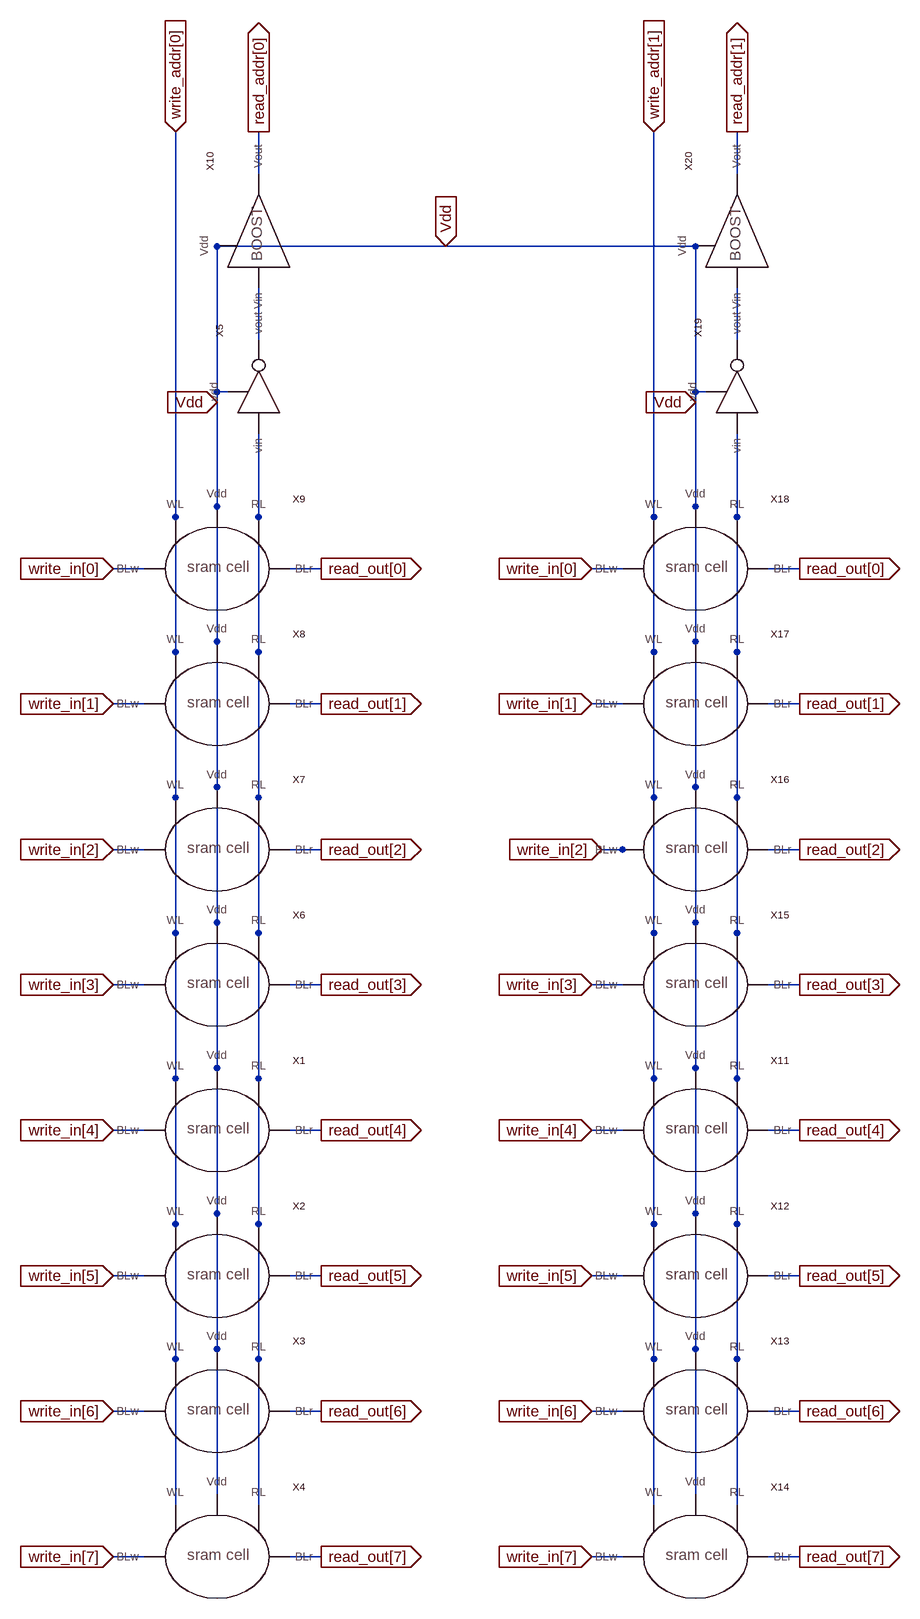
[diagram p0: schematic s_sram_block_2x8bit.asc]
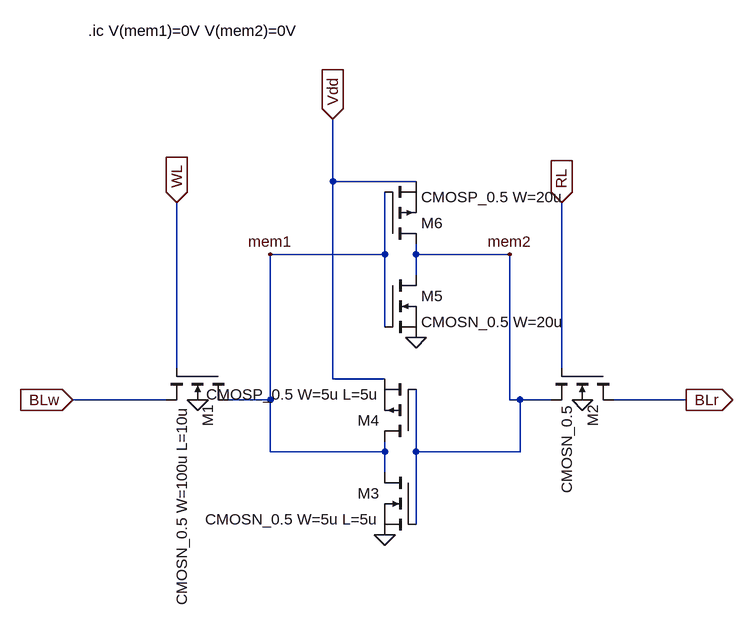
[diagram p1: sub-circuit s_sram_cell.asc]
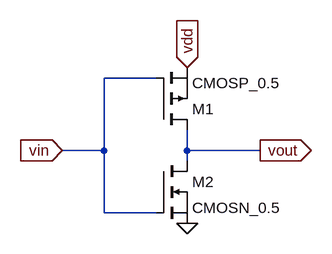
[diagram p2: sub-circuit s_inv.asc]
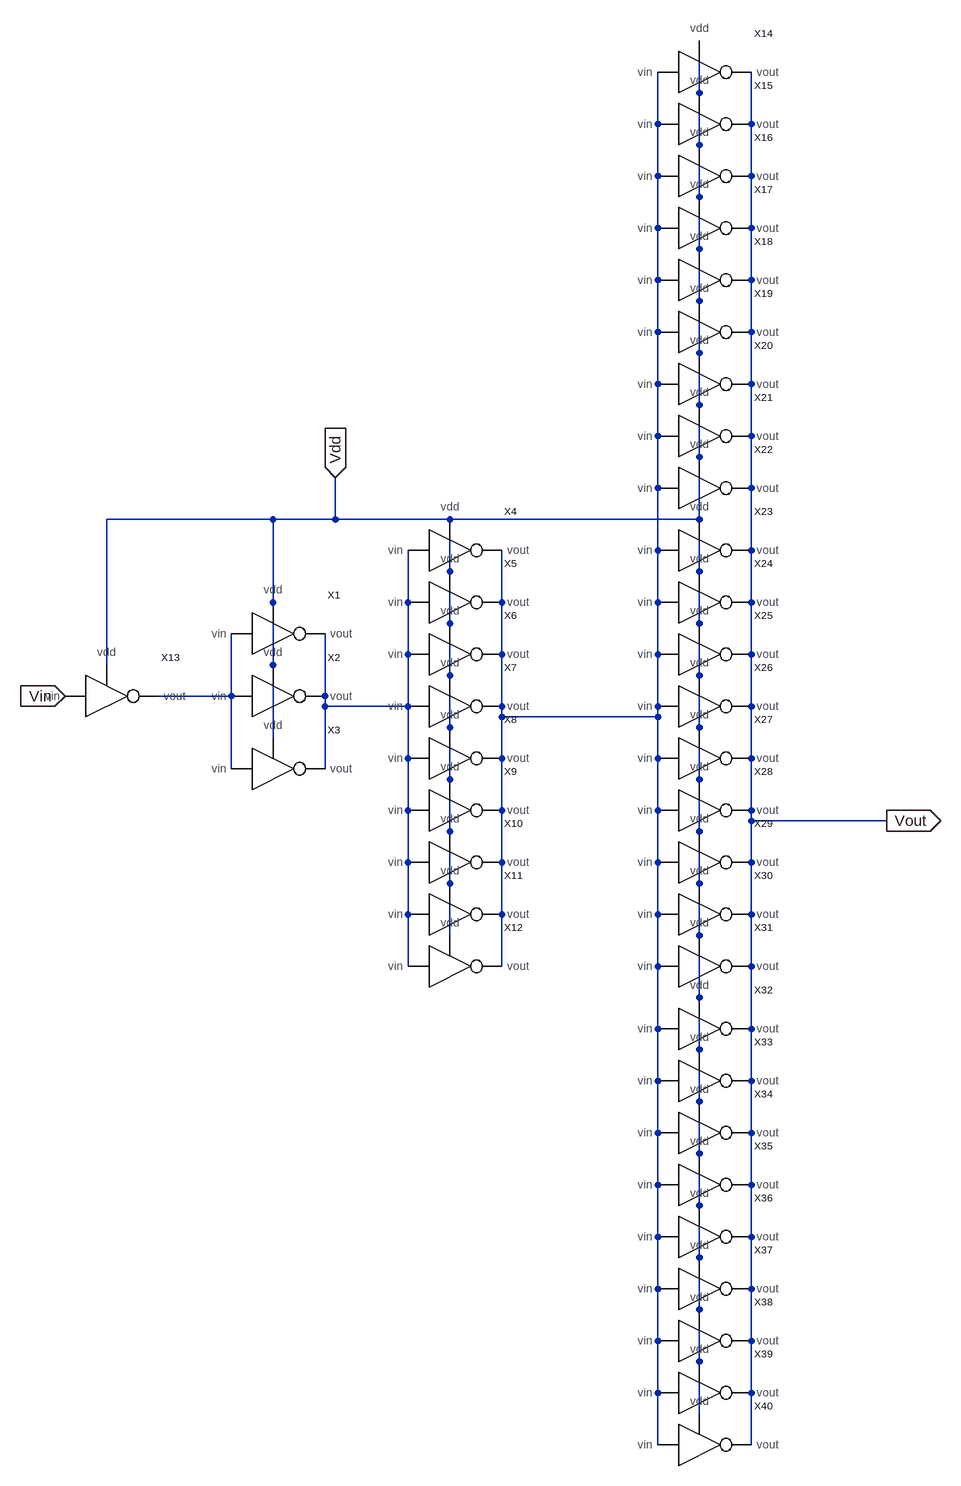
[diagram p3: sub-circuit s_current_boost.asc]
s_sram_block_2x8bit.asc, the LTspice schematic file:
Version 4
SHEET 1 1208 1108
WIRE 176 -1328 176 -1392
WIRE 912 -1328 912 -1392
WIRE 464 -1216 112 -1216
WIRE 848 -1216 464 -1216
WIRE 176 -1072 176 -1152
WIRE 912 -1072 912 -1152
WIRE 112 -992 112 -1216
WIRE 128 -992 112 -992
WIRE 848 -992 848 -1216
WIRE 864 -992 848 -992
WIRE 112 -976 112 -992
WIRE 848 -976 848 -992
WIRE 112 -816 112 -976
WIRE 848 -816 848 -976
WIRE 48 -800 48 -1392
WIRE 176 -800 176 -928
WIRE 784 -800 784 -1392
WIRE 912 -800 912 -928
WIRE 0 -720 -48 -720
WIRE 272 -720 224 -720
WIRE 736 -720 688 -720
WIRE 1008 -720 960 -720
WIRE 112 -608 112 -816
WIRE 848 -608 848 -816
WIRE 48 -592 48 -800
WIRE 176 -592 176 -800
WIRE 784 -592 784 -800
WIRE 912 -592 912 -800
WIRE 0 -512 -48 -512
WIRE 272 -512 224 -512
WIRE 736 -512 688 -512
WIRE 1008 -512 960 -512
WIRE 112 -384 112 -608
WIRE 848 -384 848 -608
WIRE 48 -368 48 -592
WIRE 176 -368 176 -592
WIRE 784 -368 784 -592
WIRE 912 -368 912 -592
WIRE 0 -288 -48 -288
WIRE 272 -288 224 -288
WIRE 736 -288 704 -288
WIRE 752 -288 736 -288
WIRE 1008 -288 960 -288
WIRE 112 -176 112 -384
WIRE 848 -176 848 -384
WIRE 48 -160 48 -368
WIRE 176 -160 176 -368
WIRE 784 -160 784 -368
WIRE 912 -160 912 -368
WIRE 0 -80 -48 -80
WIRE 272 -80 224 -80
WIRE 736 -80 688 -80
WIRE 1008 -80 960 -80
WIRE 112 48 112 -176
WIRE 848 48 848 -176
WIRE 48 64 48 -160
WIRE 176 64 176 -160
WIRE 784 64 784 -160
WIRE 912 64 912 -160
WIRE 0 144 -48 144
WIRE 272 144 224 144
WIRE 736 144 688 144
WIRE 1008 144 960 144
WIRE 112 272 112 48
WIRE 848 272 848 48
WIRE 48 288 48 64
WIRE 176 288 176 64
WIRE 784 288 784 64
WIRE 912 288 912 64
WIRE 0 368 -48 368
WIRE 272 368 224 368
WIRE 736 368 688 368
WIRE 1008 368 960 368
WIRE 112 480 112 272
WIRE 848 480 848 272
WIRE 48 496 48 288
WIRE 176 496 176 288
WIRE 784 496 784 288
WIRE 912 496 912 288
WIRE 0 576 -48 576
WIRE 272 576 224 576
WIRE 736 576 688 576
WIRE 1008 576 960 576
WIRE 112 704 112 480
WIRE 848 704 848 480
WIRE 48 720 48 496
WIRE 176 720 176 496
WIRE 784 720 784 496
WIRE 912 720 912 496
WIRE 0 800 -48 800
WIRE 272 800 224 800
WIRE 736 800 688 800
WIRE 1008 800 960 800
FLAG 112 -976 Vdd
IOPIN 112 -976 In
FLAG 48 -1392 write_addr[0]
IOPIN 48 -1392 In
FLAG 176 -1392 read_addr[0]
IOPIN 176 -1392 Out
FLAG 848 -976 Vdd
IOPIN 848 -976 In
FLAG 912 -1392 read_addr[1]
IOPIN 912 -1392 Out
FLAG 784 -1392 write_addr[1]
IOPIN 784 -1392 In
FLAG 272 -720 read_out[0]
IOPIN 272 -720 Out
FLAG 272 -512 read_out[1]
IOPIN 272 -512 Out
FLAG 272 -288 read_out[2]
IOPIN 272 -288 Out
FLAG 272 -80 read_out[3]
IOPIN 272 -80 Out
FLAG 272 144 read_out[4]
IOPIN 272 144 Out
FLAG 272 368 read_out[5]
IOPIN 272 368 Out
FLAG 272 576 read_out[6]
IOPIN 272 576 Out
FLAG 272 800 read_out[7]
IOPIN 272 800 Out
FLAG 464 -1216 Vdd
IOPIN 464 -1216 In
FLAG 1008 800 read_out[7]
IOPIN 1008 800 Out
FLAG 1008 576 read_out[6]
IOPIN 1008 576 Out
FLAG 1008 368 read_out[5]
IOPIN 1008 368 Out
FLAG 1008 144 read_out[4]
IOPIN 1008 144 Out
FLAG 1008 -80 read_out[3]
IOPIN 1008 -80 Out
FLAG 1008 -288 read_out[2]
IOPIN 1008 -288 Out
FLAG 1008 -512 read_out[1]
IOPIN 1008 -512 Out
FLAG 1008 -720 read_out[0]
IOPIN 1008 -720 Out
FLAG -48 -720 write_in[0]
IOPIN -48 -720 In
FLAG -48 -512 write_in[1]
IOPIN -48 -512 In
FLAG -48 -288 write_in[2]
IOPIN -48 -288 In
FLAG -48 -80 write_in[3]
IOPIN -48 -80 In
FLAG -48 144 write_in[4]
IOPIN -48 144 In
FLAG -48 368 write_in[5]
IOPIN -48 368 In
FLAG -48 576 write_in[6]
IOPIN -48 576 In
FLAG -48 800 write_in[7]
IOPIN -48 800 In
FLAG 688 -720 write_in[0]
IOPIN 688 -720 In
FLAG 688 -512 write_in[1]
IOPIN 688 -512 In
FLAG 704 -288 write_in[2]
IOPIN 704 -288 In
FLAG 688 -80 write_in[3]
IOPIN 688 -80 In
FLAG 688 144 write_in[4]
IOPIN 688 144 In
FLAG 688 368 write_in[5]
IOPIN 688 368 In
FLAG 688 576 write_in[6]
IOPIN 688 576 In
FLAG 688 800 write_in[7]
IOPIN 688 800 In
SYMBOL s_sram_cell 112 144 R0
SYMATTR InstName X1
SYMBOL s_sram_cell 112 368 R0
SYMATTR InstName X2
SYMBOL s_sram_cell 112 576 R0
SYMATTR InstName X3
SYMBOL s_sram_cell 112 800 R0
SYMATTR InstName X4
SYMBOL s_sram_cell 112 -80 R0
SYMATTR InstName X6
SYMBOL s_sram_cell 112 -288 R0
SYMATTR InstName X7
SYMBOL s_sram_cell 112 -512 R0
SYMATTR InstName X8
SYMBOL s_sram_cell 112 -720 R0
SYMATTR InstName X9
SYMBOL s_inv 176 -992 R270
SYMATTR InstName X5
SYMBOL s_current_boost 176 -1216 R270
SYMATTR InstName X10
SYMBOL s_sram_cell 848 144 R0
SYMATTR InstName X11
SYMBOL s_sram_cell 848 368 R0
SYMATTR InstName X12
SYMBOL s_sram_cell 848 576 R0
SYMATTR InstName X13
SYMBOL s_sram_cell 848 800 R0
SYMATTR InstName X14
SYMBOL s_sram_cell 848 -80 R0
SYMATTR InstName X15
SYMBOL s_sram_cell 848 -288 R0
SYMATTR InstName X16
SYMBOL s_sram_cell 848 -512 R0
SYMATTR InstName X17
SYMBOL s_sram_cell 848 -720 R0
SYMATTR InstName X18
SYMBOL s_inv 912 -992 R270
SYMATTR InstName X19
SYMBOL s_current_boost 912 -1216 R270
SYMATTR InstName X20

s_sram_cell.asc, the sub-circuit schematic file:
Version 4
SHEET 1 880 680
WIRE 48 -240 48 -336
WIRE 176 -240 48 -240
WIRE 128 -128 128 -224
WIRE 128 -128 -48 -128
WIRE 176 -128 176 -144
WIRE 320 -128 176 -128
WIRE 176 -96 176 -128
WIRE 128 -16 128 -128
WIRE -192 48 -192 -208
WIRE 400 48 400 -208
WIRE 48 64 48 -240
WIRE 128 64 48 64
WIRE -208 96 -352 96
WIRE -48 96 -48 -128
WIRE -48 96 -112 96
WIRE 320 96 320 -128
WIRE 336 96 320 96
WIRE 384 96 336 96
WIRE 592 96 480 96
WIRE -48 176 -48 96
WIRE 128 176 128 160
WIRE 128 176 -48 176
WIRE 176 176 176 80
WIRE 336 176 336 96
WIRE 336 176 176 176
WIRE 128 208 128 176
WIRE 176 288 176 176
FLAG -160 96 0
FLAG 432 96 0
FLAG 128 304 0
FLAG -192 -208 WL
IOPIN -192 -208 In
FLAG 400 -208 RL
IOPIN 400 -208 In
FLAG 176 0 0
FLAG 48 -336 Vdd
IOPIN 48 -336 In
FLAG -352 96 BLw
IOPIN -352 96 In
FLAG 592 96 BLr
IOPIN 592 96 Out
FLAG -48 -128 mem1
FLAG 320 -128 mem2
SYMBOL nmos4 -112 48 R90
SYMATTR InstName M1
SYMATTR Value CMOSN_0.5 W=100u L=10u
SYMBOL nmos4 480 48 R90
SYMATTR InstName M2
SYMATTR Value CMOSN_0.5
SYMBOL nmos 176 208 M0
SYMATTR InstName M3
SYMATTR Value CMOSN_0.5 W=5u L=5u
SYMBOL pmos 176 160 R180
SYMATTR InstName M4
SYMATTR Value CMOSP_0.5 W=5u L=5u
SYMBOL nmos 128 -96 R0
SYMATTR InstName M5
SYMATTR Value CMOSN_0.5 W=20u
SYMBOL pmos 128 -144 M180
SYMATTR InstName M6
SYMATTR Value CMOSP_0.5 W=20u
TEXT -328 -472 Left 2 !.ic V(mem1)=0V V(mem2)=0V

s_inv.asc, the sub-circuit schematic file:
Version 4
SHEET 1 880 680
WIRE 128 -112 48 -112
WIRE 48 0 48 -112
WIRE 48 0 -16 0
WIRE 176 0 176 -32
WIRE 288 0 176 0
WIRE 176 16 176 0
WIRE 48 96 48 0
WIRE 128 96 48 96
FLAG 288 0 vout
IOPIN 288 0 Out
FLAG -16 0 vin
IOPIN -16 0 In
FLAG 176 -128 vdd
IOPIN 176 -128 In
FLAG 176 112 0
SYMBOL pmos 128 -32 M180
SYMATTR InstName M1
SYMATTR Value CMOSP_0.5
SYMBOL nmos 128 16 R0
SYMATTR InstName M2
SYMATTR Value CMOSN_0.5

s_current_boost.asc, the sub-circuit schematic file:
Version 4
SHEET 1 1556 1460
WIRE 768 -704 768 -784
WIRE 704 -656 704 -736
WIRE 848 -656 848 -736
WIRE 768 -624 768 -704
WIRE 704 -576 704 -656
WIRE 848 -576 848 -656
WIRE 768 -544 768 -624
WIRE 704 -496 704 -576
WIRE 848 -496 848 -576
WIRE 768 -464 768 -544
WIRE 704 -416 704 -496
WIRE 848 -416 848 -496
WIRE 768 -384 768 -464
WIRE 704 -336 704 -416
WIRE 848 -336 848 -416
WIRE 768 -304 768 -384
WIRE 704 -256 704 -336
WIRE 848 -256 848 -336
WIRE 768 -224 768 -304
WIRE 704 -176 704 -256
WIRE 848 -176 848 -256
WIRE 768 -144 768 -224
WIRE 704 -96 704 -176
WIRE 848 -96 848 -176
WIRE 112 -48 -144 -48
WIRE 208 -48 208 -112
WIRE 208 -48 112 -48
WIRE 384 -48 208 -48
WIRE 768 -48 768 -144
WIRE 768 -48 384 -48
WIRE 704 0 704 -96
WIRE 848 0 848 -96
WIRE 384 32 384 -48
WIRE 768 32 768 -48
WIRE 112 80 112 -48
WIRE 320 80 320 0
WIRE 464 80 464 0
WIRE 704 80 704 0
WIRE 848 80 848 0
WIRE 384 112 384 32
WIRE 768 112 768 32
WIRE 320 160 320 80
WIRE 464 160 464 80
WIRE 704 160 704 80
WIRE 848 160 848 80
WIRE -144 176 -144 -48
WIRE 112 176 112 80
WIRE 384 192 384 112
WIRE 768 192 768 112
WIRE 48 224 48 128
WIRE 48 224 -64 224
WIRE 192 224 192 128
WIRE 192 240 192 224
WIRE 320 240 320 160
WIRE 320 240 192 240
WIRE 464 240 464 160
WIRE 704 240 704 160
WIRE 848 240 848 160
WIRE 464 256 464 240
WIRE 704 256 704 240
WIRE 704 256 464 256
WIRE 384 272 384 192
WIRE 768 272 768 192
WIRE 112 288 112 176
WIRE 320 320 320 240
WIRE 464 320 464 256
WIRE 704 320 704 256
WIRE 848 320 848 240
WIRE 48 336 48 224
WIRE 192 336 192 240
WIRE 384 352 384 272
WIRE 768 352 768 272
WIRE 320 400 320 320
WIRE 464 400 464 320
WIRE 704 400 704 320
WIRE 848 400 848 320
WIRE 848 416 848 400
WIRE 1056 416 848 416
WIRE 384 432 384 352
WIRE 768 432 768 352
WIRE 320 480 320 400
WIRE 464 480 464 400
WIRE 704 480 704 400
WIRE 848 480 848 416
WIRE 384 512 384 432
WIRE 768 512 768 432
WIRE 320 560 320 480
WIRE 464 560 464 480
WIRE 704 560 704 480
WIRE 848 560 848 480
WIRE 384 592 384 512
WIRE 768 592 768 512
WIRE 320 640 320 560
WIRE 464 640 464 560
WIRE 704 640 704 560
WIRE 848 640 848 560
WIRE 768 688 768 592
WIRE 704 736 704 640
WIRE 848 736 848 640
WIRE 768 768 768 688
WIRE 704 816 704 736
WIRE 848 816 848 736
WIRE 768 848 768 768
WIRE 704 896 704 816
WIRE 848 896 848 816
WIRE 768 928 768 848
WIRE 704 976 704 896
WIRE 848 976 848 896
WIRE 768 1008 768 928
WIRE 704 1056 704 976
WIRE 848 1056 848 976
WIRE 768 1088 768 1008
WIRE 704 1136 704 1056
WIRE 848 1136 848 1056
WIRE 768 1168 768 1088
WIRE 704 1216 704 1136
WIRE 848 1216 848 1136
WIRE 768 1248 768 1168
WIRE 704 1296 704 1216
WIRE 848 1296 848 1216
WIRE 768 1328 768 1248
WIRE 704 1376 704 1296
WIRE 848 1376 848 1296
FLAG 208 -112 Vdd
IOPIN 208 -112 In
FLAG -208 224 Vin
IOPIN -208 224 In
FLAG 1056 416 Vout
IOPIN 1056 416 Out
SYMBOL s_inv 112 128 R0
SYMATTR InstName X1
SYMBOL s_inv 112 224 R0
SYMATTR InstName X2
SYMBOL s_inv 112 336 R0
SYMATTR InstName X3
SYMBOL s_inv 384 0 R0
SYMATTR InstName X4
SYMBOL s_inv 384 80 R0
SYMATTR InstName X5
SYMBOL s_inv 384 160 R0
SYMATTR InstName X6
SYMBOL s_inv 384 240 R0
SYMATTR InstName X7
SYMBOL s_inv 384 320 R0
SYMATTR InstName X8
SYMBOL s_inv 384 400 R0
SYMATTR InstName X9
SYMBOL s_inv 384 480 R0
SYMATTR InstName X10
SYMBOL s_inv 384 560 R0
SYMATTR InstName X11
SYMBOL s_inv 384 640 R0
SYMATTR InstName X12
SYMBOL s_inv -144 224 R0
SYMATTR InstName X13
SYMBOL s_inv 768 -736 R0
SYMATTR InstName X14
SYMBOL s_inv 768 -656 R0
SYMATTR InstName X15
SYMBOL s_inv 768 -576 R0
SYMATTR InstName X16
SYMBOL s_inv 768 -496 R0
SYMATTR InstName X17
SYMBOL s_inv 768 -416 R0
SYMATTR InstName X18
SYMBOL s_inv 768 -336 R0
SYMATTR InstName X19
SYMBOL s_inv 768 -256 R0
SYMATTR InstName X20
SYMBOL s_inv 768 -176 R0
SYMATTR InstName X21
SYMBOL s_inv 768 -96 R0
SYMATTR InstName X22
SYMBOL s_inv 768 0 R0
SYMATTR InstName X23
SYMBOL s_inv 768 80 R0
SYMATTR InstName X24
SYMBOL s_inv 768 160 R0
SYMATTR InstName X25
SYMBOL s_inv 768 240 R0
SYMATTR InstName X26
SYMBOL s_inv 768 320 R0
SYMATTR InstName X27
SYMBOL s_inv 768 400 R0
SYMATTR InstName X28
SYMBOL s_inv 768 480 R0
SYMATTR InstName X29
SYMBOL s_inv 768 560 R0
SYMATTR InstName X30
SYMBOL s_inv 768 640 R0
SYMATTR InstName X31
SYMBOL s_inv 768 736 R0
SYMATTR InstName X32
SYMBOL s_inv 768 816 R0
SYMATTR InstName X33
SYMBOL s_inv 768 896 R0
SYMATTR InstName X34
SYMBOL s_inv 768 976 R0
SYMATTR InstName X35
SYMBOL s_inv 768 1056 R0
SYMATTR InstName X36
SYMBOL s_inv 768 1136 R0
SYMATTR InstName X37
SYMBOL s_inv 768 1216 R0
SYMATTR InstName X38
SYMBOL s_inv 768 1296 R0
SYMATTR InstName X39
SYMBOL s_inv 768 1376 R0
SYMATTR InstName X40

The netlist it stands for:
* s_sram_block_2x8bit.asc
XX1 Vdd write_addr[0] N003 write_in[4] read_out[4] s_sram_cell
XX2 Vdd write_addr[0] N003 write_in[5] read_out[5] s_sram_cell
XX3 Vdd write_addr[0] N003 write_in[6] read_out[6] s_sram_cell
XX4 Vdd write_addr[0] N003 write_in[7] read_out[7] s_sram_cell
XX6 Vdd write_addr[0] N003 write_in[3] read_out[3] s_sram_cell
XX7 Vdd write_addr[0] N003 write_in[2] read_out[2] s_sram_cell
XX8 Vdd write_addr[0] N003 write_in[1] read_out[1] s_sram_cell
XX9 Vdd write_addr[0] N003 write_in[0] read_out[0] s_sram_cell
XX5 N003 N001 Vdd s_inv
XX10 read_addr[0] N001 Vdd s_current_boost
XX11 Vdd write_addr[1] N004 write_in[4] read_out[4] s_sram_cell
XX12 Vdd write_addr[1] N004 write_in[5] read_out[5] s_sram_cell
XX13 Vdd write_addr[1] N004 write_in[6] read_out[6] s_sram_cell
XX14 Vdd write_addr[1] N004 write_in[7] read_out[7] s_sram_cell
XX15 Vdd write_addr[1] N004 write_in[3] read_out[3] s_sram_cell
XX16 Vdd write_addr[1] N004 write_in[2] read_out[2] s_sram_cell
XX17 Vdd write_addr[1] N004 write_in[1] read_out[1] s_sram_cell
XX18 Vdd write_addr[1] N004 write_in[0] read_out[0] s_sram_cell
XX19 N004 N002 Vdd s_inv
XX20 read_addr[1] N002 Vdd s_current_boost

* block symbol definitions
.subckt s_sram_cell Vdd WL RL BLw BLr
M1 mem1 WL BLw 0 CMOSN_0.5 W=100u L=10u
M2 BLr RL mem2 0 CMOSN_0.5
M3 mem1 mem2 0 0 CMOSN_0.5 W=5u L=5u
M4 mem1 mem2 Vdd Vdd CMOSP_0.5 W=5u L=5u
M5 mem2 mem1 0 0 CMOSN_0.5 W=20u
M6 mem2 mem1 Vdd Vdd CMOSP_0.5 W=20u
.ic V(mem1)=0V V(mem2)=0V
.ends s_sram_cell

.subckt s_inv vin vout vdd
M1 vout vin vdd vdd CMOSP_0.5
M2 vout vin 0 0 CMOSN_0.5
.ends s_inv

.subckt s_current_boost Vout Vin Vdd
XX1 N003 N002 Vdd s_inv
XX2 N003 N002 Vdd s_inv
XX3 N003 N002 Vdd s_inv
XX4 N002 N001 Vdd s_inv
XX5 N002 N001 Vdd s_inv
XX6 N002 N001 Vdd s_inv
XX7 N002 N001 Vdd s_inv
XX8 N002 N001 Vdd s_inv
XX9 N002 N001 Vdd s_inv
XX10 N002 N001 Vdd s_inv
XX11 N002 N001 Vdd s_inv
XX12 N002 N001 Vdd s_inv
XX13 Vin N003 Vdd s_inv
XX14 N001 Vout Vdd s_inv
XX15 N001 Vout Vdd s_inv
XX16 N001 Vout Vdd s_inv
XX17 N001 Vout Vdd s_inv
XX18 N001 Vout Vdd s_inv
XX19 N001 Vout Vdd s_inv
XX20 N001 Vout Vdd s_inv
XX21 N001 Vout Vdd s_inv
XX22 N001 Vout Vdd s_inv
XX23 N001 Vout Vdd s_inv
XX24 N001 Vout Vdd s_inv
XX25 N001 Vout Vdd s_inv
XX26 N001 Vout Vdd s_inv
XX27 N001 Vout Vdd s_inv
XX28 N001 Vout Vdd s_inv
XX29 N001 Vout Vdd s_inv
XX30 N001 Vout Vdd s_inv
XX31 N001 Vout Vdd s_inv
XX32 N001 Vout Vdd s_inv
XX33 N001 Vout Vdd s_inv
XX34 N001 Vout Vdd s_inv
XX35 N001 Vout Vdd s_inv
XX36 N001 Vout Vdd s_inv
XX37 N001 Vout Vdd s_inv
XX38 N001 Vout Vdd s_inv
XX39 N001 Vout Vdd s_inv
XX40 N001 Vout Vdd s_inv
.ends s_current_boost

.model NMOS NMOS
.model PMOS PMOS
.lib standard.mos
.backanno
.end